# Altium schematic sheet FPGA.SchDoc
size A3
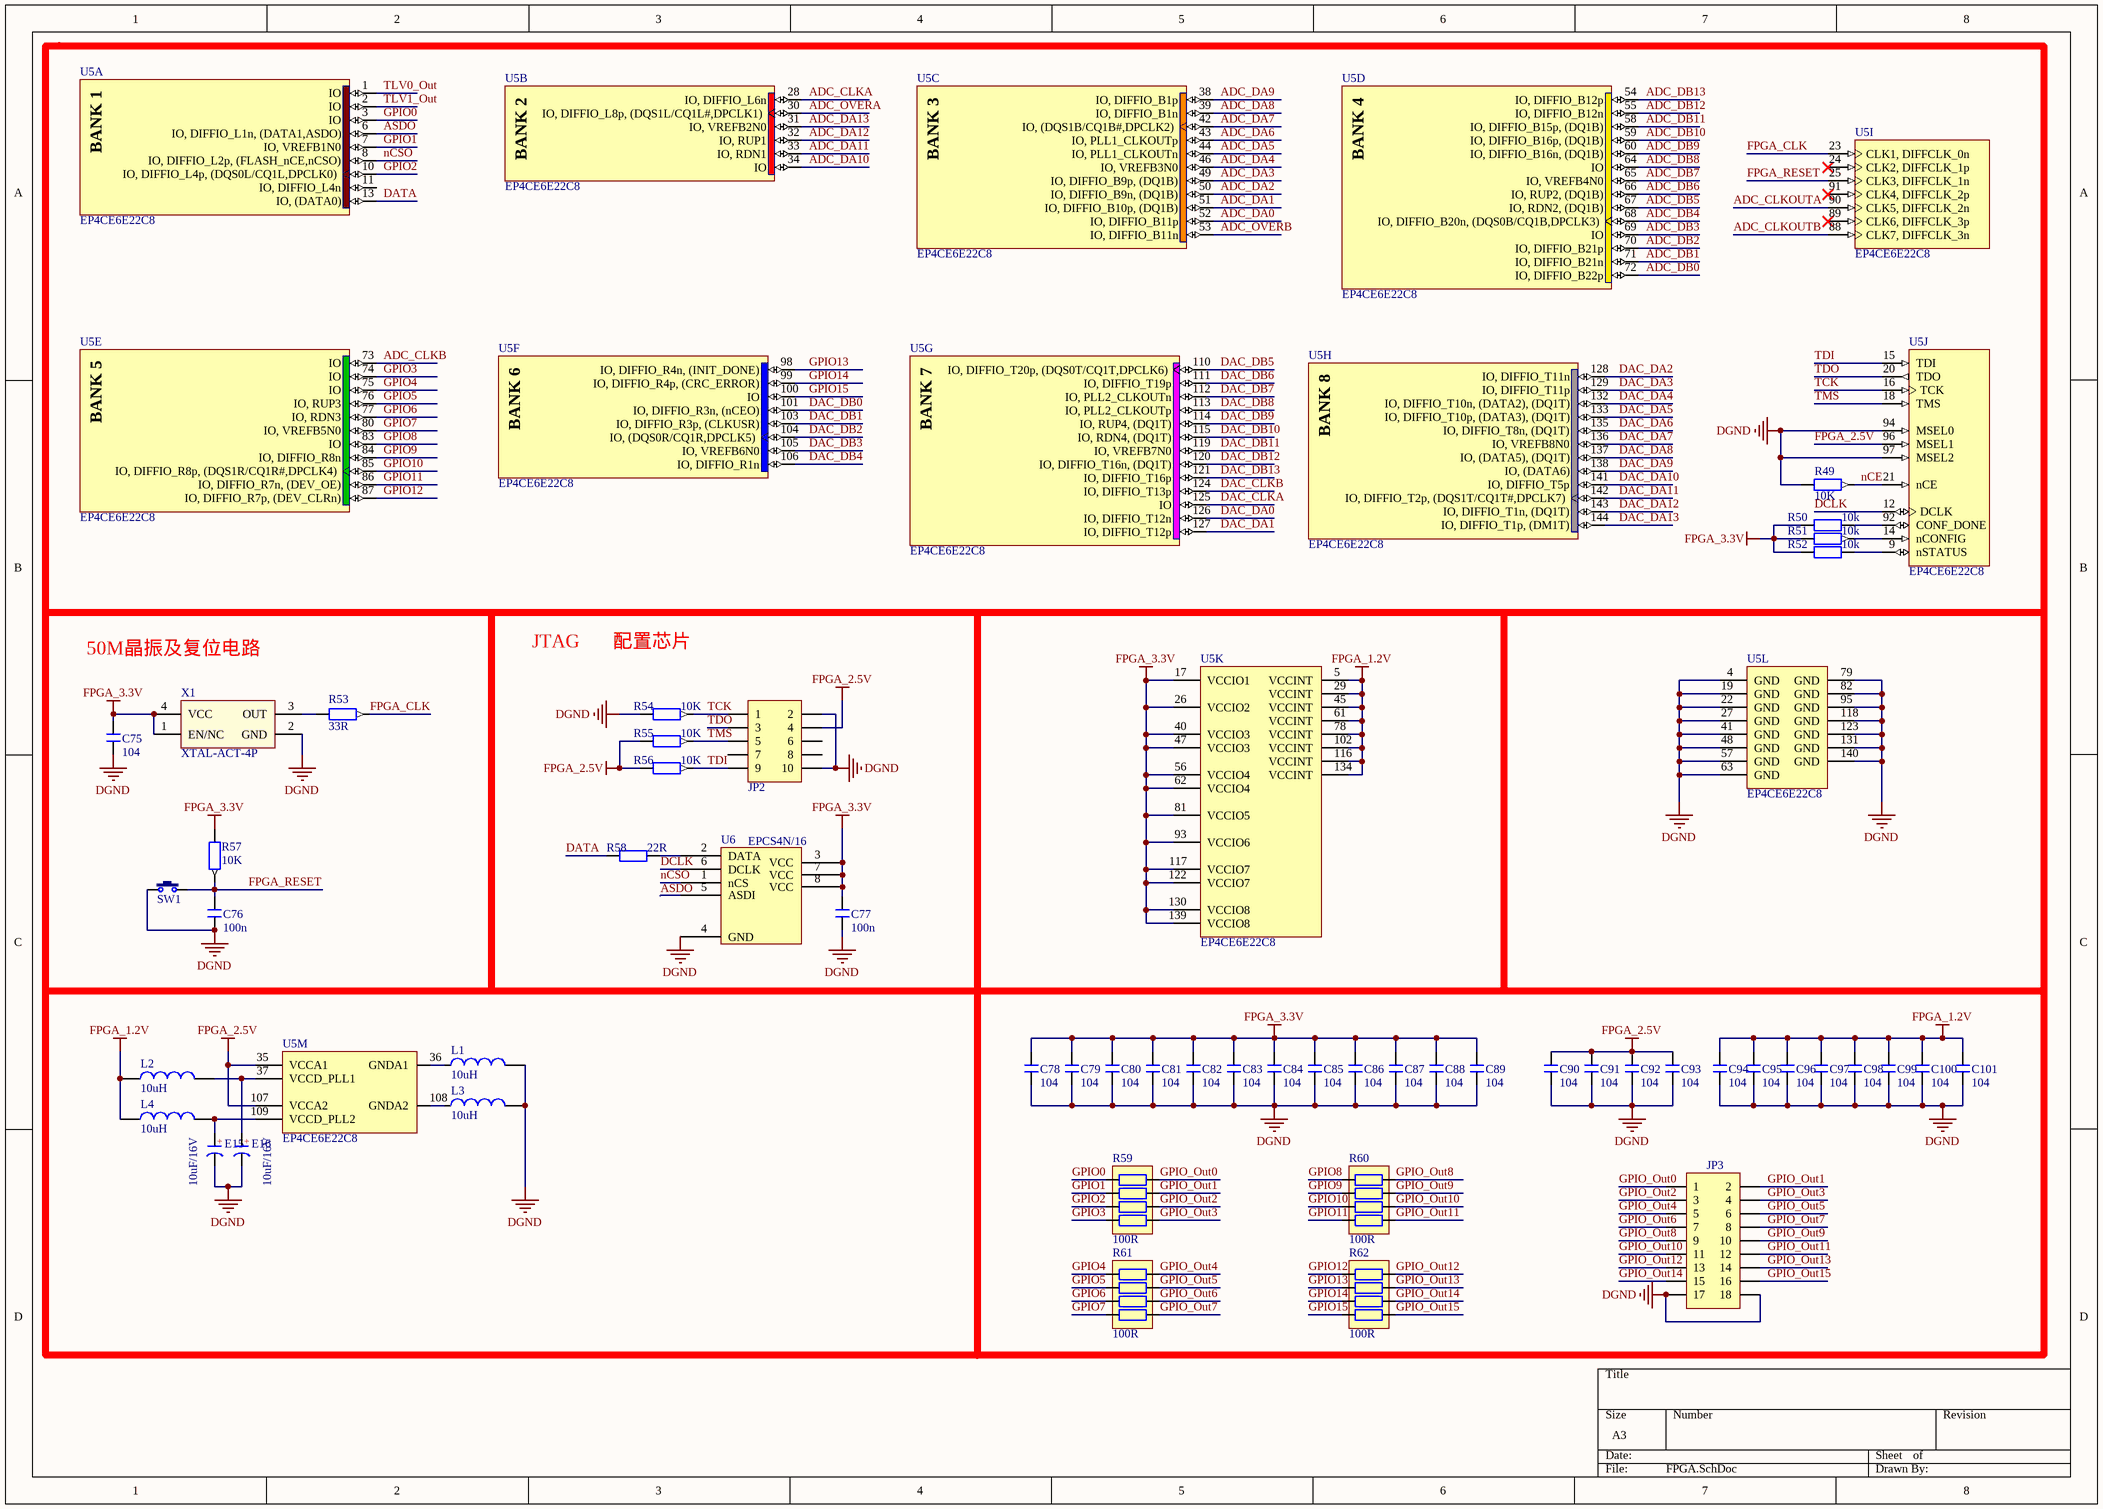
[diagram p0: FPGA.SchDoc]

## Parts
C75  104  [C 0805_M]
C76  100n  [C 0805_M]
C77  100n  [C 0805_M]
C78  104  [C 0805_M]
C79  104  [C 0805_M]
C80  104  [C 0805_M]
C81  104  [C 0805_M]
C82  104  [C 0805_M]
C83  104  [C 0805_M]
C84  104  [C 0805_M]
C85  104  [C 0805_M]
C86  104  [C 0805_M]
C87  104  [C 0805_M]
C88  104  [C 0805_M]
C89  104  [C 0805_M]
C90  104  [C 0805_M]
C91  104  [C 0805_M]
C92  104  [C 0805_M]
C93  104  [C 0805_M]
C94  104  [C 0805_M]
C95  104  [C 0805_M]
C96  104  [C 0805_M]
C97  104  [C 0805_M]
C98  104  [C 0805_M]
C99  104  [C 0805_M]
C100  104  [C 0805_M]
C101  104  [C 0805_M]
E15  10uF/16V  [C 1210_M]
E16  10uF/16V  [C 1210_M]
JP2  Header 5X2  [IDC2.54-LI-2x5P]  (value not drawn)
JP3  Header 9X2  [HDR2.54-LI-2x9P]  (value not drawn)
L1  10uH  [L 0805]
L2  10uH  [L 0805]
L3  10uH  [L 0805]
L4  10uH  [L 0805]
R49  10K  [R 0805_M]
R50  10k  [R 0805_M]
R51  10k  [R 0805_M]
R52  10k  [R 0805_M]
R53  33R  [R 0805_M]
R54  10K  [R 0805_M]
R55  10K  [R 0805_M]
R56  10K  [R 0805_M]
R57  10K  [R 0805_M]
R58  22R  [R 0805_M]
R59  100R  [RCA-8P4R-0603]
R60  100R  [RCA-8P4R-0603]
R61  100R  [RCA-8P4R-0603]
R62  100R  [RCA-8P4R-0603]
SW1  3x6x5  [TSW SMD-3*6*2.5]  (value not drawn)
U5  EP4CE6E22C8  [EQFP144_M]  (parts A,B,C,D,E,F,G,H,I,J,K,L,M of 13)
U6  EPCS4N/16  [SOP8_M]
X1  XTAL-ACT-4P  [OSC 7050-4P]

## Nets
DGND: C75.1 C76.1 C77.1 C78.1 C79.1 C80.1 C81.1 C82.1 C83.1 C84.1 C85.1 C86.1 C87.1 C88.1 C89.1 C90.1 C91.1 C92.1 C93.1 C94.1 C95.1 C96.1 C97.1 C98.1 C99.1 C100.1 C101.1 E15.2(K) E16.2(K) JP2.2 JP2.10 JP3.17 JP3.18 L1.2 L3.2 R49.1 R54.2 SW1.1 U5.4(GND) U5.19(GND) U5.22(GND) U5.27(GND) U5.41(GND) U5.48(GND) U5.57(GND) U5.63(GND) U5.79(GND) U5.82(GND) U5.94(MSEL0) U5.95(GND) U5.97(MSEL2) U5.118(GND) U5.123(GND) U5.131(GND) U5.140(GND) U6.4(GND) X1.2(GND)
FPGA_1.2V: C94.2 C95.2 C96.2 C97.2 C98.2 C99.2 C100.2 C101.2 L2.1 L4.1 U5.5(VCCINT) U5.29(VCCINT) U5.45(VCCINT) U5.61(VCCINT) U5.78(VCCINT) U5.102(VCCINT) U5.116(VCCINT) U5.134(VCCINT)
FPGA_2.5V: C90.2 C91.2 C92.2 C93.2 JP2.4 R55.2 R56.2 U5.35(VCCA1) U5.96(MSEL1) U5.107(VCCA2)
FPGA_3.3V: C75.2 C77.2 C78.2 C79.2 C80.2 C81.2 C82.2 C83.2 C84.2 C85.2 C86.2 C87.2 C88.2 C89.2 R50.1 R51.1 R52.1 R57.2 U5.17(VCCIO1) U5.26(VCCIO2) U5.40(VCCIO3) U5.47(VCCIO3) U5.56(VCCIO4) U5.62(VCCIO4) U5.81(VCCIO5) U5.93(VCCIO6) U5.117(VCCIO7) U5.122(VCCIO7) U5.130(VCCIO8) U5.139(VCCIO8) U6.3(VCC) U6.7(VCC) U6.8(VCC) X1.1(EN/NC) X1.4(VCC)
ADC_CLKA: U5.28(IO,_DIFFIO_L6n)
ADC_CLKB: U5.73(IO)
ADC_CLKOUTA: U5.90(CLK5,_DIFFCLK_2n)
ADC_CLKOUTB: U5.88(CLK7,_DIFFCLK_3n)
ADC_DA0: U5.52(IO,_DIFFIO_B11p)
ADC_DA1: U5.51(IO,_DIFFIO_B10p,_(DQ1B))
ADC_DA2: U5.50(IO,_DIFFIO_B9n,_(DQ1B))
ADC_DA3: U5.49(IO,_DIFFIO_B9p,_(DQ1B))
ADC_DA4: U5.46(IO,_VREFB3N0)
ADC_DA5: U5.44(IO,_PLL1_CLKOUTn)
ADC_DA6: U5.43(IO,_PLL1_CLKOUTp)
ADC_DA7: U5.42(IO,_(DQS1B/CQ1B#,DPCLK2))
ADC_DA8: U5.39(IO,_DIFFIO_B1n)
ADC_DA9: U5.38(IO,_DIFFIO_B1p)
ADC_DA10: U5.34(IO)
ADC_DA11: U5.33(IO,_RDN1)
ADC_DA12: U5.32(IO,_RUP1)
ADC_DA13: U5.31(IO,_VREFB2N0)
ADC_DB0: U5.72(IO,_DIFFIO_B22p)
ADC_DB1: U5.71(IO,_DIFFIO_B21n)
ADC_DB2: U5.70(IO,_DIFFIO_B21p)
ADC_DB3: U5.69(IO)
ADC_DB4: U5.68(IO,_DIFFIO_B20n,_(DQS0B/CQ1B,DPCLK3))
ADC_DB5: U5.67(IO,_RDN2,_(DQ1B))
ADC_DB6: U5.66(IO,_RUP2,_(DQ1B))
ADC_DB7: U5.65(IO,_VREFB4N0)
ADC_DB8: U5.64(IO)
ADC_DB9: U5.60(IO,_DIFFIO_B16n,_(DQ1B))
ADC_DB10: U5.59(IO,_DIFFIO_B16p,_(DQ1B))
ADC_DB11: U5.58(IO,_DIFFIO_B15p,_(DQ1B))
ADC_DB12: U5.55(IO,_DIFFIO_B12n)
ADC_DB13: U5.54(IO,_DIFFIO_B12p)
ADC_OVERA: U5.30(IO,_DIFFIO_L8p,_(DQS1L/CQ1L#,DPCLK1))
ADC_OVERB: U5.53(IO,_DIFFIO_B11n)
ASDO: U5.6(IO,_DIFFIO_L1n,_(DATA1,ASDO)) U6.5(ASDI)
DAC_CLKA: U5.125(IO)
DAC_CLKB: U5.124(IO,_DIFFIO_T13p)
DAC_DA0: U5.126(IO,_DIFFIO_T12n)
DAC_DA1: U5.127(IO,_DIFFIO_T12p)
DAC_DA2: U5.128(IO,_DIFFIO_T11n)
DAC_DA3: U5.129(IO,_DIFFIO_T11p)
DAC_DA4: U5.132(IO,_DIFFIO_T10n,_(DATA2),_(DQ1T))
DAC_DA5: U5.133(IO,_DIFFIO_T10p,_(DATA3),_(DQ1T))
DAC_DA6: U5.135(IO,_DIFFIO_T8n,_(DQ1T))
DAC_DA7: U5.136(IO,_VREFB8N0)
DAC_DA8: U5.137(IO,_(DATA5),_(DQ1T))
DAC_DA9: U5.138(IO,_(DATA6))
DAC_DA10: U5.141(IO,_DIFFIO_T5p)
DAC_DA11: U5.142(IO,_DIFFIO_T2p,_(DQS1T/CQ1T#,DPCLK7))
DAC_DA12: U5.143(IO,_DIFFIO_T1n,_(DQ1T))
DAC_DA13: U5.144(IO,_DIFFIO_T1p,_(DM1T))
DAC_DB0: U5.101(IO,_DIFFIO_R3n,_(nCEO))
DAC_DB1: U5.103(IO,_DIFFIO_R3p,_(CLKUSR))
DAC_DB2: U5.104(IO,_(DQS0R/CQ1R,DPCLK5))
DAC_DB3: U5.105(IO,_VREFB6N0)
DAC_DB4: U5.106(IO,_DIFFIO_R1n)
DAC_DB5: U5.110(IO,_DIFFIO_T20p,_(DQS0T/CQ1T,DPCLK6))
DAC_DB6: U5.111(IO,_DIFFIO_T19p)
DAC_DB7: U5.112(IO,_PLL2_CLKOUTn)
DAC_DB8: U5.113(IO,_PLL2_CLKOUTp)
DAC_DB9: U5.114(IO,_RUP4,_(DQ1T))
DAC_DB10: U5.115(IO,_RDN4,_(DQ1T))
DAC_DB11: U5.119(IO,_VREFB7N0)
DAC_DB12: U5.120(IO,_DIFFIO_T16n,_(DQ1T))
DAC_DB13: U5.121(IO,_DIFFIO_T16p)
DATA: R58.2 U5.13(IO,_(DATA0))
DCLK: U5.12(DCLK) U6.6(DCLK)
FPGA_CLK: R53.2 U5.23(CLK1,_DIFFCLK_0n)
FPGA_RESET: C76.2 R57.1 SW1.2 U5.25(CLK3,_DIFFCLK_1n)
GPIO0: R59.8 U5.3(IO)
GPIO1: R59.7 U5.7(IO,_VREFB1N0)
GPIO2: R59.6 U5.10(IO,_DIFFIO_L4p,_(DQS0L/CQ1L,DPCLK0))
GPIO3: R59.5 U5.74(IO)
GPIO4: R61.4 U5.75(IO)
GPIO5: R61.3 U5.76(IO,_RUP3)
GPIO6: R61.2 U5.77(IO,_RDN3)
GPIO7: R61.1 U5.80(IO,_VREFB5N0)
GPIO8: R60.8 U5.83(IO)
GPIO9: R60.7 U5.84(IO,_DIFFIO_R8n)
GPIO10: R60.6 U5.85(IO,_DIFFIO_R8p,_(DQS1R/CQ1R#,DPCLK4))
GPIO11: R60.5 U5.86(IO,_DIFFIO_R7n,_(DEV_OE))
GPIO12: R62.8 U5.87(IO,_DIFFIO_R7p,_(DEV_CLRn))
GPIO13: R62.7 U5.98(IO,_DIFFIO_R4n,_(INIT_DONE))
GPIO14: R62.6 U5.99(IO,_DIFFIO_R4p,_(CRC_ERROR))
GPIO15: R62.5 U5.100(IO)
GPIO_Out0: JP3.1 R59.1
GPIO_Out1: JP3.2 R59.2
GPIO_Out2: JP3.3 R59.3
GPIO_Out3: JP3.4 R59.4
GPIO_Out4: JP3.5 R61.5
GPIO_Out5: JP3.6 R61.6
GPIO_Out6: JP3.7 R61.7
GPIO_Out7: JP3.8 R61.8
GPIO_Out8: JP3.9 R60.1
GPIO_Out9: JP3.10 R60.2
GPIO_Out10: JP3.11 R60.3
GPIO_Out11: JP3.12 R60.4
GPIO_Out12: JP3.13 R62.1
GPIO_Out13: JP3.14 R62.2
GPIO_Out14: JP3.15 R62.3
GPIO_Out15: JP3.16 R62.4
nCE: R49.2 U5.21(nCE)
nCSO: U5.8(IO,_DIFFIO_L2p,_(FLASH_nCE,nCSO)) U6.1(nCS)
TCK: JP2.1 R54.1 U5.16(TCK)
TDI: JP2.9 R56.1 U5.15(TDI)
TDO: JP2.3 U5.20(TDO)
TLV0_Out: U5.1(IO)
TLV1_Out: U5.2(IO)
TMS: JP2.5 R55.1 U5.18(TMS)
NetE15_1: E15.1(A) L4.2 U5.109(VCCD_PLL2)
NetE16_1: E16.1(A) L2.2 U5.37(VCCD_PLL1)
NetL1_1: L1.1 U5.36(GNDA1)
NetL3_1: L3.1 U5.108(GNDA2)
NetR50_2: R50.2 U5.92(CONF_DONE)
NetR51_2: R51.2 U5.14(nCONFIG)
NetR52_2: R52.2 U5.9(nSTATUS)
NetR53_1: R53.1 X1.3(OUT)
NetR58_1: R58.1 U6.2(DATA)

Not connected (* = marked no-connect by the designer): JP2 6 7 8; U5 11(IO,_DIFFIO_L4n) 24(CLK2,_DIFFCLK_1p)* 89(CLK6,_DIFFCLK_3p)* 91(CLK4,_DIFFCLK_2p)*

## Notes on the sheet
- JTAG
- 配置芯片
- 50M晶振及复位电路
- (in symbol C-CAP) +
- (in symbol EP4CE6E22C8, part A) BANK 1
- (in symbol EP4CE6E22C8, part B) BANK 2
- (in symbol EP4CE6E22C8, part C) BANK 3
- (in symbol EP4CE6E22C8, part D) BANK 4
- (in symbol EP4CE6E22C8, part E) BANK 5
- (in symbol EP4CE6E22C8, part F) BANK 6
- (in symbol EP4CE6E22C8, part G) BANK 7
- (in symbol EP4CE6E22C8, part H) BANK 8

## Library data of the parts
C75-C101 = C: 无极性贴片电容; 版权归属: 源创客; BOM名称: 无极性贴片电容; 学习资源: www.ooocke.com
E15 E16 = C-CAP: 直插电解电容; 版权归属: 源创客; BOM名称: 直插电解电容; 学习资源: www.ooocke.com
JP2 = Header 5X2: 5*2P接插件; 版权归属: 源创客; BOM名称: 5*2P接插件; 学习资源: www.ooocke.com
JP3 = Header 9X2: 9*2P接插件; 版权归属: 源创客; BOM名称: 9*2P接插件; 学习资源: www.ooocke.com
L1-L4 = L: 小功率贴片电感; 版权归属: 源创客; BOM名称: 小功率贴片电感; 学习资源: www.ooocke.com
R49 = Res2: Resistor; Published: 8-Jun-2000; LatestRevisionDate: 17-Jul-2002; LatestRevisionNote: Re-released for DXP Platform.; PackageReference: AXIAL-0.4; Publisher: Altium Limited; PackageDescription: Axial Device, Thru-Hole; 2 Leads; 0.4 in Pin Spacing
R50-R58 = R: 贴片电阻; 版权归属: 源创客; BOM名称: 贴片电阻; 学习资源: www.ooocke.com
R59-R62 = R-8P4R: 贴片网络排阻; 版权归属: 源创客; BOM名称: 贴片网络排阻; 学习资源: www.ooocke.com
SW1 = TSW 3x6: 3x6轻触开关; 版权归属: 源创客; BOM名称: 3x6轻触开关; 学习资源: www.ooocke.com
U5 = EP4CE6E22C8: Cyclone IV Family FPGA, 2V Core, 91 I/O Pins, 2 PLLs, 144-Pin QFP, Speed Grade 8, Commercial Grade; Published: 3-May-2010; DatasheetVersion: ver1.2, Mar-2010; PackageVersion: ver16.0, Dec-2009; PackageReference: EQFP144; Publisher: Altium Limited; PackageDescription: 144-Pin Plastic Enhanced Quad Flat Pack (EQFP144) - Wire Bond; Supplier 1: Digi-Key; Supplier Part Number 1: EP4CE6E22C8-ND; Code_JEDEC: MS-026-BFB; ComponentLink1Description: Manufacturer Link; ComponentLink1URL: http://www.altera.com/; ComponentLink2Description: Handbook; ComponentLink2URL: http://www.altera.com/literature/hb/cyclone-iv/cyclone4-handbook.pdf; ComponentLink3Description: Pinout Specification; ComponentLink3URL: http://www.altera.com/literature/lit-dp.jsp?category=cyc%204&showspreadsheet=y; ComponentLink4Description: Packaging Specification; ComponentLink4URL: http://www.altera.com/literature/ds/dspkg.pdf
U6 = EPCS1SI8
X1 = XTAL-ACT-4P: 4脚有源晶振